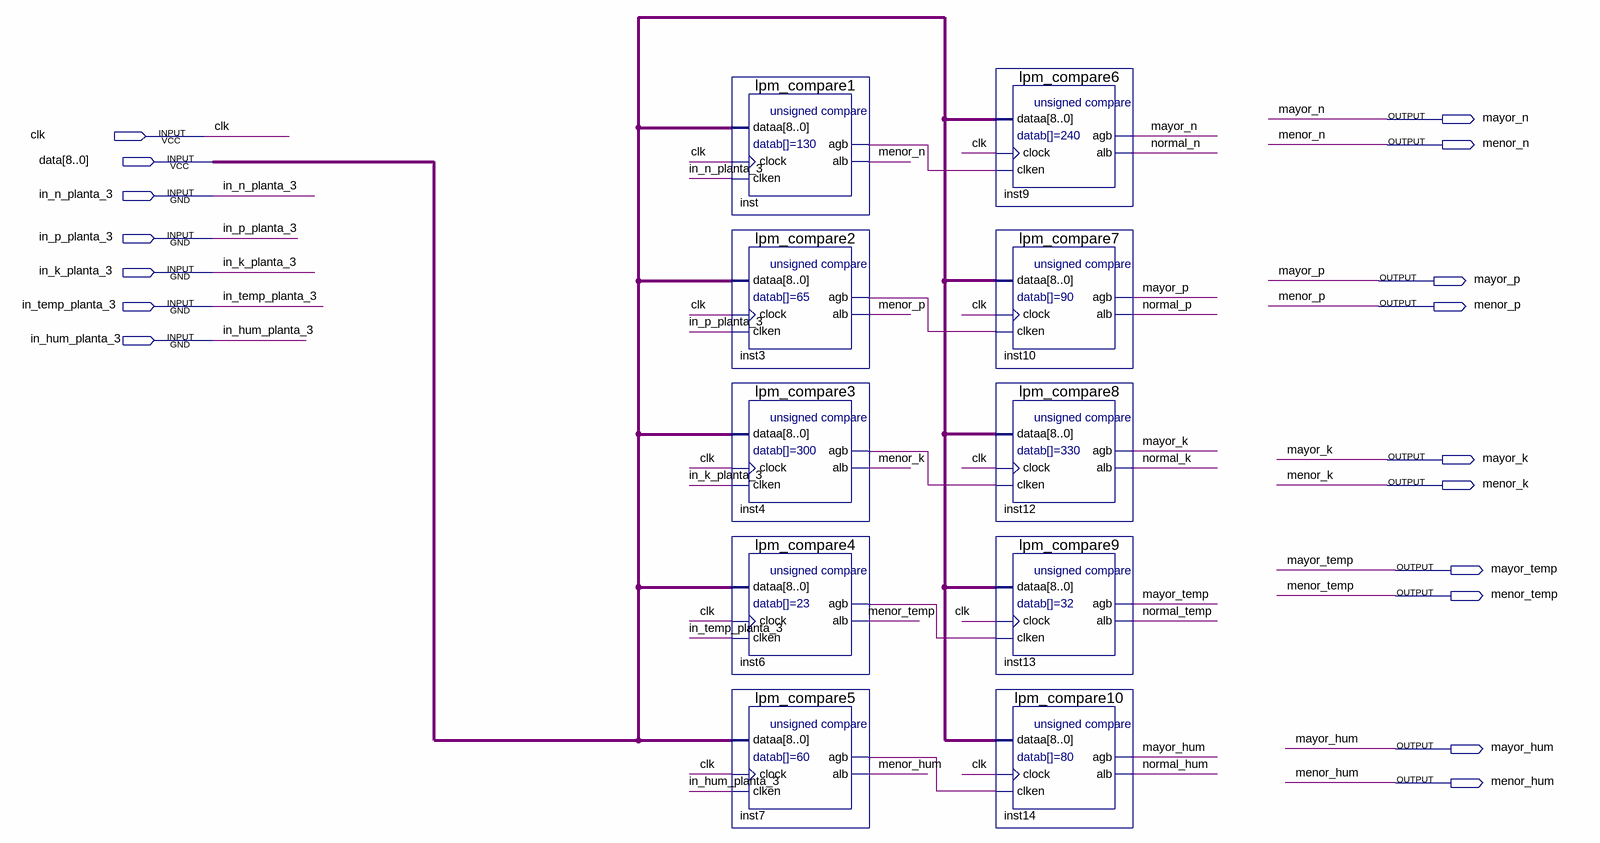
[diagram p0: schematic sheet]
// Quartus schematic Comparador_planta_3.bdf as structural Verilog: 10 symbols, 17 pins
module Comparador_planta_3 (
  input  clk,
  input  [8:0] data,
  input  in_n_planta_3,
  input  in_p_planta_3,
  input  in_k_planta_3,
  input  in_temp_planta_3,
  input  in_hum_planta_3,
  output mayor_n,
  output menor_n,
  output mayor_p,
  output menor_p,
  output mayor_k,
  output menor_k,
  output mayor_temp,
  output menor_temp,
  output mayor_hum,
  output menor_hum
);

  wire inst3_agb, inst4_agb, inst6_agb, inst7_agb, inst_agb, normal_hum, normal_k, normal_n, normal_p,
       normal_temp;

  lpm_compare1 inst (.dataa(data), .clock(clk), .clken(in_n_planta_3), .agb(inst_agb), .alb(menor_n));
  lpm_compare2 inst3 (.dataa(data), .clock(clk), .clken(in_p_planta_3), .agb(inst3_agb), .alb(menor_p));
  lpm_compare3 inst4 (.dataa(data), .clock(clk), .clken(in_k_planta_3), .agb(inst4_agb), .alb(menor_k));
  lpm_compare4 inst6 (.dataa(data), .clock(clk), .clken(in_temp_planta_3), .agb(inst6_agb), .alb(menor_temp));
  lpm_compare5 inst7 (.dataa(data), .clock(clk), .clken(in_hum_planta_3), .agb(inst7_agb), .alb(menor_hum));
  lpm_compare6 inst9 (.dataa(data), .clock(clk), .clken(inst_agb), .agb(mayor_n), .alb(normal_n));
  lpm_compare7 inst10 (.dataa(data), .clock(clk), .clken(inst3_agb), .agb(mayor_p), .alb(normal_p));
  lpm_compare8 inst12 (.dataa(data), .clock(clk), .clken(inst4_agb), .agb(mayor_k), .alb(normal_k));
  lpm_compare9 inst13 (.dataa(data), .clock(clk), .clken(inst6_agb), .agb(mayor_temp), .alb(normal_temp));
  lpm_compare10 inst14 (.dataa(data), .clock(clk), .clken(inst7_agb), .agb(mayor_hum), .alb(normal_hum));
endmodule
